# Altium schematic sheet DISPLAY.SchDoc: =ProjectName
size A4; CheckedBy: DatNB; Author: Ven; CompanyName: Nacentech; Organization: IMET
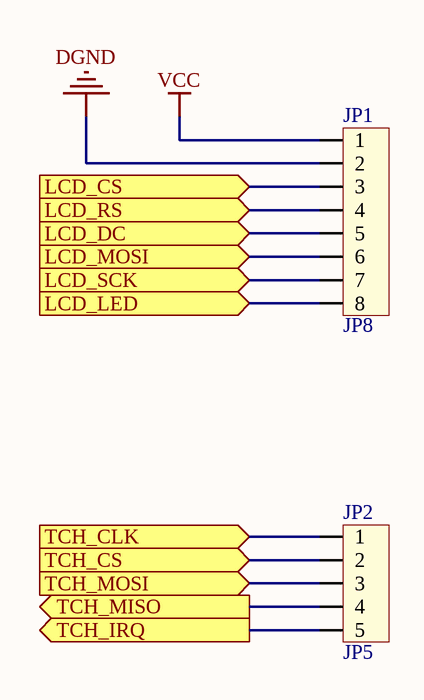
[diagram p0: DISPLAY.SchDoc]

## Parts
JP1  JP8  [CON8]
JP2  JP5  [CON5]

## Ports
LCD_CS (in), LCD_DC (in), LCD_LED (in), LCD_MOSI (in), LCD_RS (in), LCD_SCK (in), TCH_CLK (in), TCH_CS (in), TCH_IRQ (out), TCH_MISO (out), TCH_MOSI (in)

## Nets
DGND: JP1.2
VCC: JP1.1
LCD_CS: JP1.3 ; port LCD_CS
LCD_DC: JP1.5 ; port LCD_DC
LCD_LED: JP1.8 ; port LCD_LED
LCD_MOSI: JP1.6 ; port LCD_MOSI
LCD_RS: JP1.4 ; port LCD_RS
LCD_SCK: JP1.7 ; port LCD_SCK
TCH_CLK: JP2.1 ; port TCH_CLK
TCH_CS: JP2.2 ; port TCH_CS
TCH_IRQ: JP2.5 ; port TCH_IRQ
TCH_MISO: JP2.4 ; port TCH_MISO
TCH_MOSI: JP2.3 ; port TCH_MOSI

## Notes on the sheet
- Project:
- Page Contents:
- Size:
- Date:
- A4
- Checked by:
- Time:
- Revision:
- Sheet
- of
- File:

## Library data of the parts
JP1 = Con8: Connector 8; Value: Connector 8
JP2 = Con5: Connector 5; Value: Connector 5